# EAGLE design generic RGB LED driver (EAGLE 7.3.0)
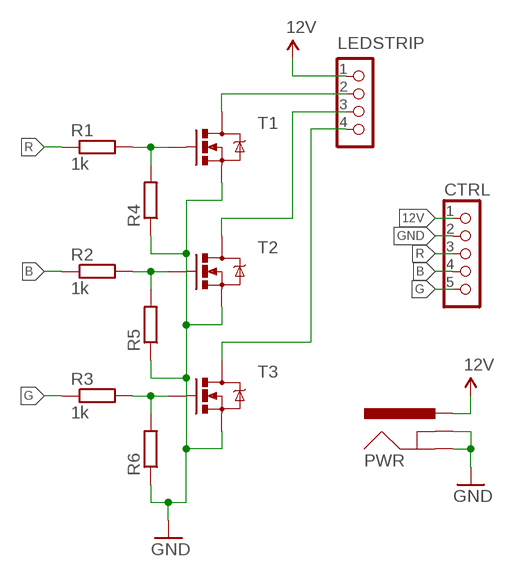
[diagram p0: schematic, sheet 1]

## Parts
CTRL  CON_HEADER_1X05-PTH  [M1X5]
LEDSTRIP  12vBRG  CON_HEADER_1X04  [M1X4]
PWR  POWER_JACKPTH  [POWER_JACK_PTH]
R1  1k  RESISTOR-0603  [R603]
R2  1k  RESISTOR-0603  [R603]
R3  1k  RESISTOR-0603  [R603]
R4  RESISTOR-0603  [R603]
R5  RESISTOR-0603  [R603]
R6  RESISTOR-0603  [R603]
T1  MOSFET-NCHANNELFDD8780  [DPAK]
T2  MOSFET-NCHANNELFDD8780  [DPAK]
T3  MOSFET-NCHANNELFDD8780  [DPAK]

## Nets
12V: CTRL.1 LEDSTRIP.1 PWR.PWR
B: CTRL.4 R2.1
G: CTRL.5 R3.1
GND: CTRL.2 PWR.GND PWR.GNDBREAK R4.1 R5.1 R6.1 T1.3(S) T2.3(S) T3.3(S)
N$1: R1.2 R4.2 T1.1(G)
N$2: R2.2 R5.2 T2.1(G)
N$3: R3.2 R6.2 T3.1(G)
N$4: LEDSTRIP.2 T1.4(D)
N$5: LEDSTRIP.3 T2.4(D)
N$6: LEDSTRIP.4 T3.4(D)
R: CTRL.3 R1.1

## Library data of the parts
CTRL = dp_devices:CON_HEADER_1X05
LEDSTRIP = dp_devices:CON_HEADER_1X04
PWR = SparkFun-Connectors:POWER_JACK: Power Jack This is the standard 5.5mm barrel jack for power. The PTH is the most common, proven, reliable, footprint. The Slot footprint only works if the mill layer is transmitted to the PCB fab house so be warned. Mating wall wart : TOL-00298 (and others); PROD_ID: CONN-08197
R1-R6 = dp_devices:RESISTOR
T1-T3 = SparkFun-DiscreteSemi:MOSFET-NCHANNEL: Common NMOSFET Parts MFG P/N Store ID Prod ID FDD8780 TRANS-09984 SI7820DN TRANS-11055 FDS6630A IC-08089 2N7002PW TRANS-11151 FQP30N06L COM-10213 TRANS-10060 BSS123LT1G TRANS-08345 BSS138 TRANS-00830 BS170 2N7000; PROD_ID: TRANS-09984

## Board
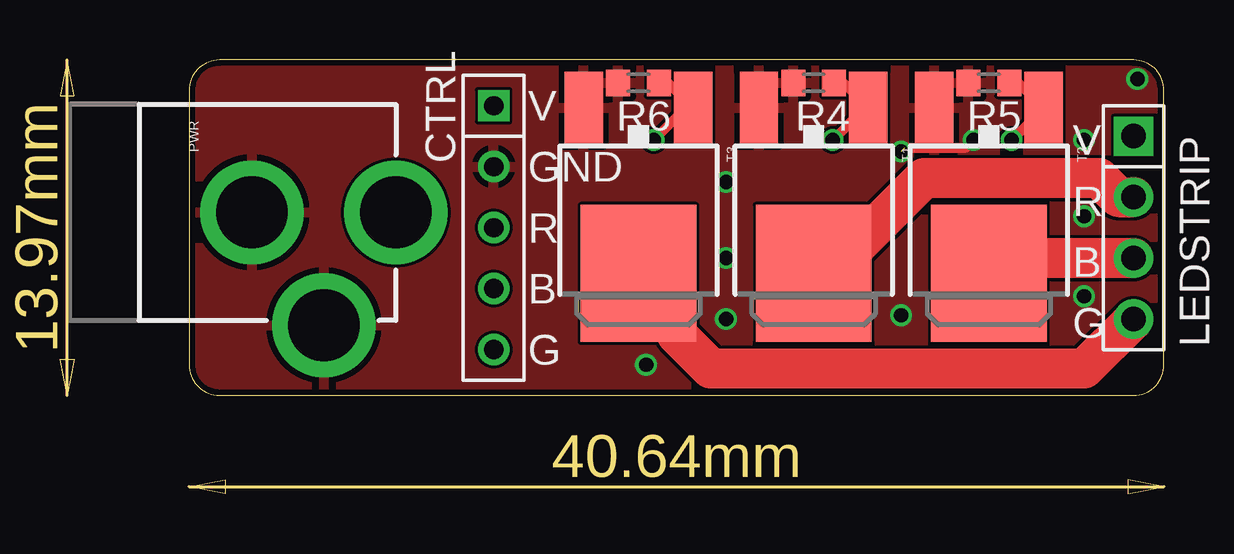
[diagram p1: board, top side]
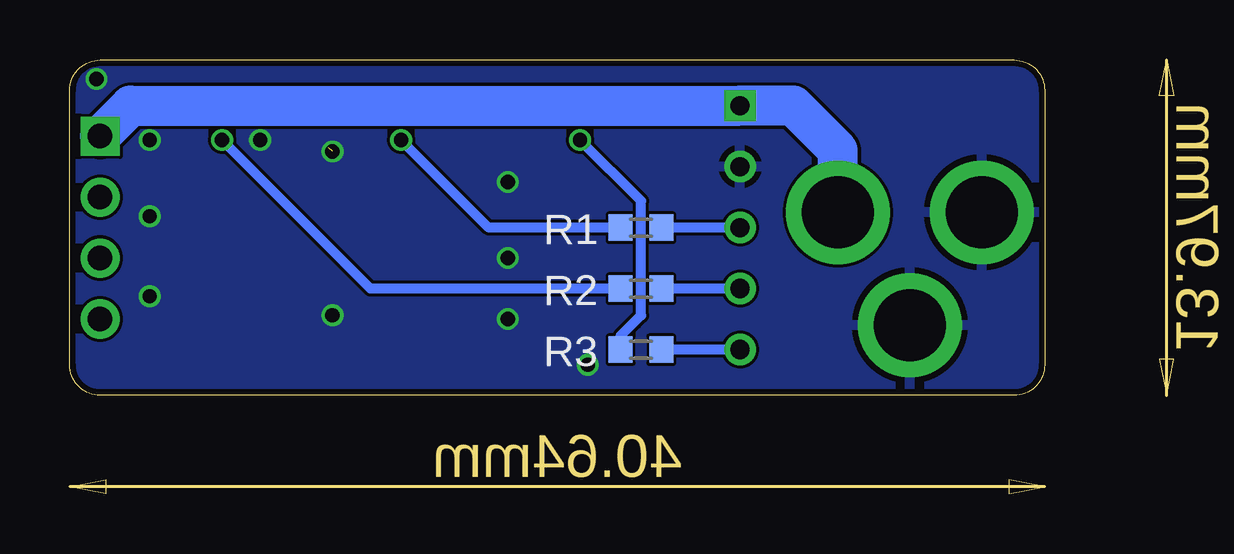
[diagram p2: board, bottom side, seen from below]

Size 40.64 x 13.97 mm. Coordinates in mm from the lower left corner, seen from the top.
Outline: 0,12.7 0,1.27 arc90 1.27,0 39.37,0 arc90 40.64,1.27 40.64,12.7 arc90 39.37,13.97 1.27,13.97 arc90 0,12.7
Copper layers (1*16): Top 0.035mm / dielectric 1.5mm / Bottom 0.035mm
Design rules "dirt_cheap_dirty_boards.v1": minimum track width 5mil, minimum drill 12mil, track to track 5mil, track to pad 5mil, pad to pad 5mil, via to via 5mil, smd to smd 0mil, copper to edge 10mil, drill to drill 10mil, minimum pad ring 10mil, minimum via ring 6mil, stop-mask expansion 2mil, vias tented up to drill 25mil, thermal gap 10mil

### Footprints (pad centres in the part's own frame; a part is rotated, then mirrored left to right if it is on the bottom)
M1X5 = drill 0.8 square: 1 -5.08,0 | drill 0.8: 2 -2.54,0; 3 0,0; 4 2.54,0; 5 5.08,0
M1X4 = drill 1.02 pad 1.632 square: 1 0,0 | drill 1.02 pad 1.632: 2 2.54,0; 3 5.08,0; 4 7.62,0
POWER_JACK_PTH = drill 2.997 pad 4.318: GND 0,7.7; GNDBREAK 4.7,10.7; PWR 0,13.7
R603 = smd 1 x 1.1: 1 -0.85,0; 2 0.85,0
DPAK = smd 1.6 x 3: 1 -2.28,-5.31; 3 2.28,-5.31 | smd 4.826 x 5.715: 4 0,1.588

### Placement (x,y rotation side)
CTRL  12.7,6.99 270 top
LEDSTRIP  39.37,10.79 270 top
PWR  -5.08,7.62 270 top
R1  16.83,6.99 180 bottom
R2  16.83,4.45 180 bottom
R3  16.83,1.91 180 bottom
R4  26.04,13.02 0 top
R5  33.34,13.02 0 top
R6  18.73,13.02 0 top
T1  26.04,6.67 180 top
T2  33.34,6.67 180 top
T3  18.73,6.67 180 top

### Tracks (layer width: path | path; a pad name or v marks a point on that pad's centre or on a via)
12V
  Bottom 1.676: PWR.PWR 8.62,10.21 10.48,12.06 CTRL.1 38.1,12.06 LEDSTRIP.1
B
  Bottom 0.406: CTRL.4 R2.1
G
  Bottom 0.406: CTRL.5 R3.1
GND  (via drill 0.6)  (1 unrouted)
  Top 0.406: 29.84,10.32 32.38,10.32
  other vias: 32.7,10.64 29.69,3.33 19.05,1.27 22.38,8.89 39.53,13.18 37.31,10.64 37.31,7.46 37.31,4.13 22.38,5.71 22.38,3.17 29.69,10.16
  pour Bottom: 0,13.97 40.64,13.97 40.64,0 0,0
  pour Top: 0,13.97 40.64,13.97 40.64,0 0,0
N$1  (via drill 0.6)
  Top 0.406: R4.2 27.27,13.02 T1.1 28.17,11.98 v26.83,10.64
  Bottom 0.406: R1.2 23.18,6.99 v26.83,10.64
N$2  (via drill 0.6)
  Top 0.406: R5.2 34.58,13.02 T2.1 35.62,11.96 v34.29,10.64
  Bottom 0.406: R2.2 28.1,4.45 v34.29,10.64
N$3  (via drill 0.6)
  Top 0.406: R6.2 19.97,13.02 T3.1 20.71,11.98 v19.37,10.64
  Bottom 0.406: R3.2 17.68,2.48 16.83,3.33 16.83,8.1 v19.37,10.64
N$4
  Top 1.676: T1.4 26.83,5.87 27.46,5.87 30.64,9.05 37.94,9.05 38.73,8.26 LEDSTRIP.2
N$5
  Top 1.676: LEDSTRIP.3 33.97,5.71 T2.4
N$6
  Top 1.676: LEDSTRIP.4 37.31,1.11 21.75,1.11 20.32,2.54 20.32,3.49 T3.4
R
  Bottom 0.406: CTRL.3 R1.1

### Text on the board
tNames: V / R / B / G | V / GND / R / B / G